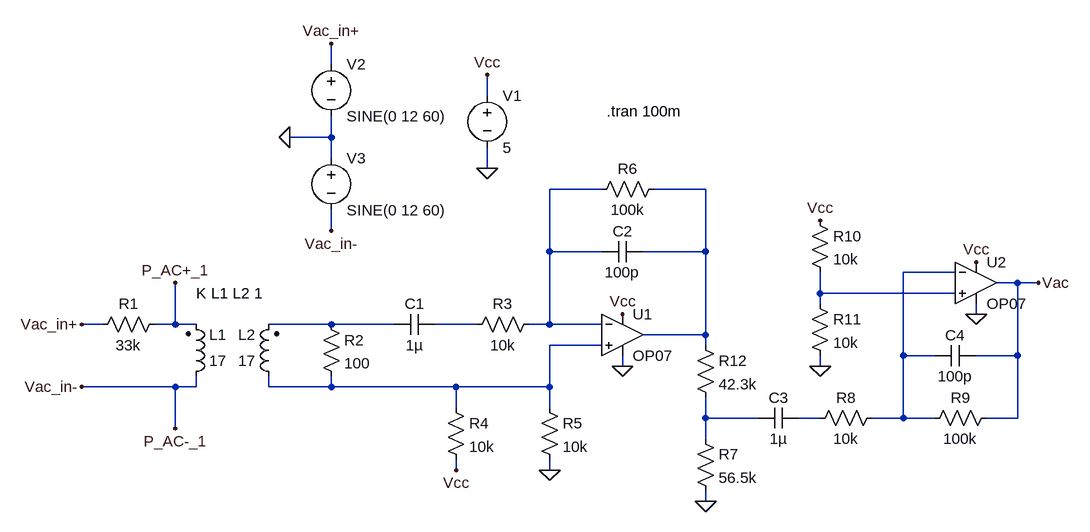
[diagram p0: schematic AC_Voltage_Sensing2.asc]
AC_Voltage_Sensing2.asc, the LTspice schematic file:
Version 4
SHEET 1 1528 680
WIRE 320 -288 320 -320
WIRE 560 -240 560 -272
WIRE 320 -176 320 -208
WIRE 320 -176 256 -176
WIRE 320 -144 320 -176
WIRE 560 -128 560 -160
WIRE 736 -96 656 -96
WIRE 896 -96 816 -96
WIRE 320 -32 320 -64
WIRE 656 0 656 -96
WIRE 736 0 656 0
WIRE 896 0 896 -96
WIRE 896 0 800 0
WIRE 1280 32 1200 32
WIRE 1376 48 1344 48
WIRE 1408 48 1376 48
WIRE 1072 64 1072 32
WIRE 1280 64 1072 64
WIRE 1072 80 1072 64
WIRE 1312 96 1312 80
WIRE -32 112 -64 112
WIRE 80 112 80 48
WIRE 80 112 48 112
WIRE 112 112 80 112
WIRE 320 112 224 112
WIRE 416 112 320 112
WIRE 544 112 480 112
WIRE 656 112 656 0
WIRE 656 112 624 112
WIRE 736 112 656 112
WIRE 896 128 896 0
WIRE 896 128 800 128
WIRE 736 144 656 144
WIRE 896 144 896 128
WIRE 1200 160 1200 32
WIRE 1248 160 1200 160
WIRE 1376 160 1376 48
WIRE 1376 160 1312 160
WIRE 768 176 768 160
WIRE 1072 176 1072 160
WIRE 80 208 -64 208
WIRE 112 208 112 192
WIRE 112 208 80 208
WIRE 224 208 224 192
WIRE 320 208 320 192
WIRE 320 208 224 208
WIRE 512 208 320 208
WIRE 656 208 656 144
WIRE 656 208 512 208
WIRE 512 240 512 208
WIRE 656 240 656 208
WIRE 896 256 896 224
WIRE 976 256 896 256
WIRE 1072 256 1040 256
WIRE 1200 256 1200 160
WIRE 1200 256 1152 256
WIRE 1248 256 1200 256
WIRE 1376 256 1376 160
WIRE 1376 256 1328 256
WIRE 80 272 80 208
WIRE 896 288 896 256
WIRE 512 336 512 320
WIRE 656 336 656 320
WIRE 896 384 896 368
FLAG 560 -272 Vcc
FLAG 512 336 Vcc
FLAG 656 336 0
FLAG 768 176 0
FLAG 768 96 Vcc
FLAG 896 384 0
FLAG 1312 96 0
FLAG 1312 16 Vcc
FLAG 1072 176 0
FLAG 1072 -48 Vcc
FLAG 1408 48 Vac
FLAG 560 -128 0
FLAG 256 -176 0
FLAG 320 -320 Vac_in+
FLAG 320 -32 Vac_in-
FLAG -64 112 Vac_in+
FLAG -64 208 Vac_in-
FLAG 80 48 P_AC+_1
FLAG 80 272 P_AC-_1
SYMBOL ind2 96 208 M180
WINDOW 0 36 80 Left 2
WINDOW 3 36 40 Left 2
SYMATTR InstName L1
SYMATTR Value 17
SYMATTR Type ind
SYMBOL ind2 240 208 R180
WINDOW 0 36 80 Left 2
WINDOW 3 36 40 Left 2
SYMATTR InstName L2
SYMATTR Value 17
SYMATTR Type ind
SYMBOL res 64 96 R90
WINDOW 0 0 56 VBottom 2
WINDOW 3 32 56 VTop 2
SYMATTR InstName R1
SYMATTR Value 33k
SYMBOL res 304 96 R0
SYMATTR InstName R2
SYMATTR Value 100
SYMBOL cap 480 96 R90
WINDOW 0 0 32 VBottom 2
WINDOW 3 32 32 VTop 2
SYMATTR InstName C1
SYMATTR Value 1µ
SYMBOL res 640 96 R90
WINDOW 0 0 56 VBottom 2
WINDOW 3 32 56 VTop 2
SYMATTR InstName R3
SYMATTR Value 10k
SYMBOL res 496 224 R0
SYMATTR InstName R4
SYMATTR Value 10k
SYMBOL res 640 224 R0
SYMATTR InstName R5
SYMATTR Value 10k
SYMBOL voltage 560 -256 R0
WINDOW 123 0 0 Left 0
WINDOW 39 0 0 Left 0
SYMATTR InstName V1
SYMATTR Value 5
SYMBOL Opamps\\OP07 768 64 R0
SYMATTR InstName U1
SYMBOL cap 800 -16 R90
WINDOW 0 0 32 VBottom 2
WINDOW 3 32 32 VTop 2
SYMATTR InstName C2
SYMATTR Value 100p
SYMBOL res 832 -112 R90
WINDOW 0 0 56 VBottom 2
WINDOW 3 32 56 VTop 2
SYMATTR InstName R6
SYMATTR Value 100k
SYMBOL res 880 272 R0
SYMATTR InstName R7
SYMATTR Value 56.5k
SYMBOL cap 1040 240 R90
WINDOW 0 0 32 VBottom 2
WINDOW 3 32 32 VTop 2
SYMATTR InstName C3
SYMATTR Value 1µ
SYMBOL res 1168 240 R90
WINDOW 0 0 56 VBottom 2
WINDOW 3 32 56 VTop 2
SYMATTR InstName R8
SYMATTR Value 10k
SYMBOL Opamps\\OP07 1312 -16 R0
SYMATTR InstName U2
SYMBOL cap 1312 144 R90
WINDOW 0 0 32 VBottom 2
WINDOW 3 32 32 VTop 2
SYMATTR InstName C4
SYMATTR Value 100p
SYMBOL res 1344 240 R90
WINDOW 0 0 56 VBottom 2
WINDOW 3 32 56 VTop 2
SYMATTR InstName R9
SYMATTR Value 100k
SYMBOL res 1056 -64 R0
SYMATTR InstName R10
SYMATTR Value 10k
SYMBOL res 1056 64 R0
SYMATTR InstName R11
SYMATTR Value 10k
SYMBOL voltage 320 -304 R0
WINDOW 123 0 0 Left 0
WINDOW 39 0 0 Left 0
SYMATTR InstName V2
SYMATTR Value SINE(0 12 60)
SYMBOL voltage 320 -160 R0
WINDOW 123 0 0 Left 0
WINDOW 39 0 0 Left 0
SYMATTR InstName V3
SYMATTR Value SINE(0 12 60)
SYMBOL res 880 128 R0
SYMATTR InstName R12
SYMATTR Value 42.3k
TEXT 112 64 Left 2 !K L1 L2 1
TEXT 744 -216 Left 2 !.tran 100m

The netlist it stands for:
* AC_Voltage_Sensing2.asc
L1 P_AC-_1 P_AC+_1 17
L2 N007 N005 17
R1 P_AC+_1 Vac_in+ 33k
R2 N005 N007 100
C1 N006 N005 1µ
R3 N001 N006 10k
R4 N007 Vcc 10k
R5 N007 0 10k
V1 Vcc 0 5
XU1 N007 N001 Vcc 0 N002 LT1001  ; OP07, pins In+ In- V+ V- OUT
C2 N002 N001 100p
R6 N002 N001 100k
R7 N008 0 56.5k
C3 N009 N008 1µ
R8 N003 N009 10k
XU2 N004 N003 Vcc 0 Vac LT1001  ; OP07, pins In+ In- V+ V- OUT
C4 Vac N003 100p
R9 Vac N003 100k
R10 Vcc N004 10k
R11 N004 0 10k
V2 Vac_in+ 0 SINE(0 12 60)
V3 0 P_AC-_1 SINE(0 12 60)
R12 N002 N008 42.3k
K L1 L2 1
.tran 100m
.lib LTC.lib
.backanno
.end